# Altium project RPi-CM-Lite.PrjPcb (part 3 of 5)
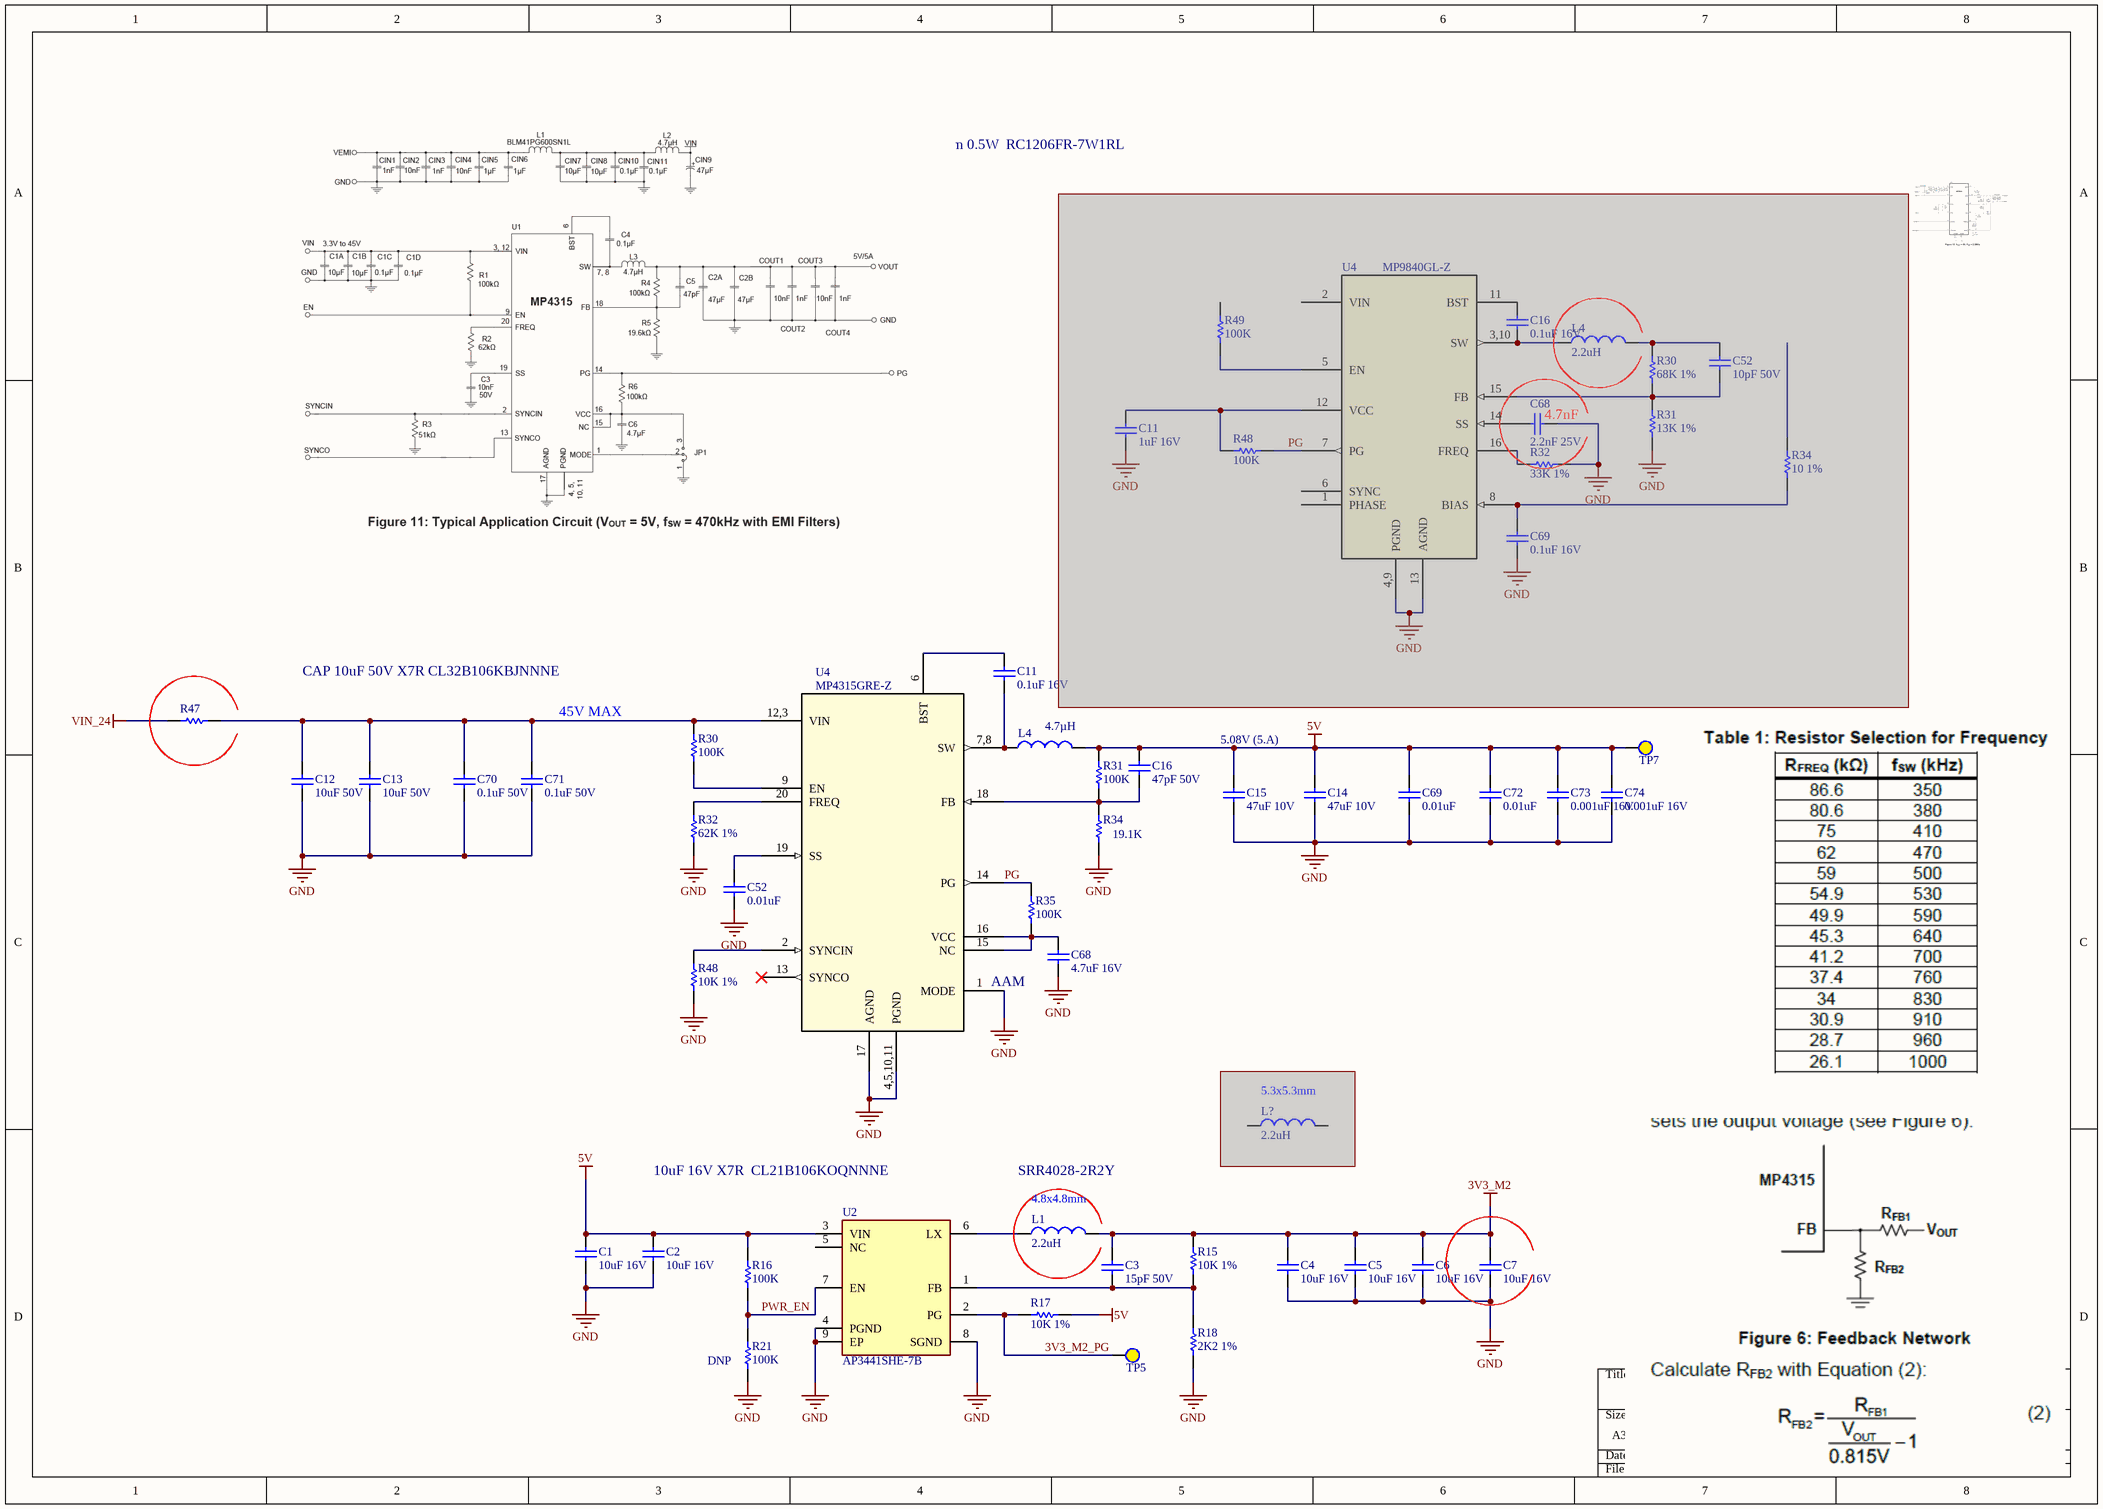
[diagram p8: Power.SchDoc]

## Sheet Power.SchDoc (continued)

### Library data of the parts (continued)
R34#2 = Res_19K1_0402: Res Thick Film 0402 19.1K Ohm 1% 0.063W(1/16W) ±100ppm/C Pad SMD T/R Automotive AEC-Q200; Manufacturer: Yageo Group; Manufacturer Part Number: AC0402FR-0719K1L; Value: 19.1kΩ; Temperature Coefficient: 100ppm/°C; Max Power Dissipation: 63mW; Power Dissipation: 62.5mW; Voltage Rating: 50V; Supplier 1: Mouser; RoHS: Compliant; Category: Chip SMD Resistors; Packaging: Tape & Reel; Tolerance: 1%; Composition: Thick Film; Features: Automotive AEC-Q200, Moisture Resistant; Height: 320µm; Number of Terminations: 2; ComponentLink1URL: https://datasheet.octopart.com:443/AC0402FR-0719K1L-Yageo-datasheet-182189377.pdf?src-supplier=IHS; ComponentLink1Description: https://datasheet.octopart.com:443/AC0402FR-0719K1L-Yageo-datasheet-182189377.pdf?src-supplier=IHS; Supplier Part Number 1: 603-AC0402FR-0719K1L; Supplier: Mouser; Supplier Part Number: 603-AC0402FR-0719K1L; Stock: 45979; Pricing: 1=0.1, 1=0.086, 10=0.008, 10=0.007, 50=0.008, 100=0.005, 100=0.004, 1000=0.005, 10000=0.002, 10000=0.002 (USD); Case/Package: 0402; Case Code (Imperial): 0402; Case Code (Metric): 1005; China RoHS: Non-Compliant; Length: 990.6µm; Lifecycle Status: Production; Max Operating Temperature: 155°C; Min Operating Temperature: -55°C; Mounting Technology: Surface Mount; Number of Terminals: 2; Power Rating: 62.5mW; REACH SVHC: Yes; Schedule B: 8533210045, 8533210045|8533210045|8533210045|8533210045|8533210045; Termination: SMD/SMT; Weight: 652.039032µg; Width: 500µm; Working Voltage: 50V; ComponentLink2URL: https://datasheet.octopart.com:443/AC0402FR-0719K1L-Yageo-datasheet-83209224.pdf?src-supplier=Upverter; ComponentLink2Description: https://datasheet.octopart.com:443/AC0402FR-0719K1L-Yageo-datasheet-83209224.pdf?src-supplier=Upverter; ComponentLink3URL: https://datasheet.octopart.com:443/AC0402FR-0719K1L-Yageo-datasheet-178509465.pdf?src-supplier=element14+APAC; ComponentLink3Description: https://datasheet.octopart.com:443/AC0402FR-0719K1L-Yageo-datasheet-178509465.pdf?src-supplier=element14+APAC; ComponentLink4URL: https://datasheet.octopart.com:443/AC0402FR-0719K1L-Yageo-datasheet-166720450.pdf?src-supplier=Future+Electronics; ComponentLink4Description: https://datasheet.octopart.com:443/AC0402FR-0719K1L-Yageo-datasheet-166720450.pdf?src-supplier=Future+Electronics; ComponentLink5URL: https://datasheet.octopart.com:443/AC0402FR-0719K1L-Yageo-datasheet-151884373.pdf?src-supplier=Future+Electronics; ComponentLink5Description: https://datasheet.octopart.com:443/AC0402FR-0719K1L-Yageo-datasheet-151884373.pdf?src-supplier=Future+Electronics; ComponentLink6URL: https://datasheet.octopart.com:443/AC0402FR-0719K1L-Yageo-datasheet-137699919.pdf?src-supplier=Future+Electronics; ComponentLink6Description: https://datasheet.octopart.com:443/AC0402FR-0719K1L-Yageo-datasheet-137699919.pdf?src-supplier=Future+Electronics; ComponentLink7URL: https://datasheet.octopart.com:443/AC0402FR-0719K1L-Yageo-Group-datasheet-164768995.pdf?src-supplier=ODG+(Origin+Data+Global); ComponentLink7Description: https://datasheet.octopart.com:443/AC0402FR-0719K1L-Yageo-Group-datasheet-164768995.pdf?src-supplier=ODG+(Origin+Data+Global); ComponentLink8URL: https://datasheet.octopart.com/AC0402FR-0719K1L-Yageo-datasheet-12512238.pdf; ComponentLink8Description: https://datasheet.octopart.com/AC0402FR-0719K1L-Yageo-datasheet-12512238.pdf; ComponentLink9URL: https://datasheet.octopart.com:443/AC0402FR-0719K1L-Yageo-datasheet-140571090.pdf?src-supplier=Arrow.cn; ComponentLink9Description: https://datasheet.octopart.com:443/AC0402FR-0719K1L-Yageo-datasheet-140571090.pdf?src-supplier=Arrow.cn; ComponentLink10URL: http://sigma.octopart.com:80/rohs_statement/Yageo-company-2.pdf?src-supplier=Compliance+Statements; ComponentLink10Description: http://sigma.octopart.com:80/rohs_statement/Yageo-company-2.pdf?src-supplier=Compliance+Statements; ComponentLink11URL: http://sigma.octopart.com:80/conflict_mineral_statement/Yageo-company-3.pdf?src-supplier=Compliance+Statements; ComponentLink11Description: http://sigma.octopart.com:80/conflict_mineral_statement/Yageo-company-3.pdf?src-supplier=Compliance+Statements
R47 = Res_1206: Resistor 1206
U2 = AP3441SHE-7B: DC-DC Switching Buck Regulator, Adjustable, 2.7 V to 5.5V in, 0.6 V to 5.5 V/3 A out, UDFN2020-EP-8; Manufacturer_Name: Diodes Incorporated; Manufacturer: Diodes Inc.; Max Switching Frequency: 1.2MHz; Min Input Voltage: 2.7V; Min Output Voltage: 600mV; Nominal Supply Voltage: 5V; Nominal Output Voltage: 2.5V; Number of Circuits: 1; Datasheet Link: https://www.diodes.com//assets/Datasheets/AP3441-L.pdf; Height: 0.6mm; Manufacturer_Part_Number: AP3441SHE-7B; Mouser Part Number: 621-AP3441SHE-7B; Mouser Price/Stock: https://www.mouser.co.uk/ProductDetail/Diodes-Incorporated/AP3441SHE-7B?qs=wUXugUrL1qwsM8sMU6r4Ag%3D%3D; Arrow Part Number: AP3441SHE-7B; Arrow Price/Stock: https://www.arrow.com/en/products/ap3441she-7b/diodes-incorporated?region=nac; Supplier: Mouser; Supplier Part Number: 621-AP3441SHE-7B; Manufacturer Part Number: AP3441SHE-7B; RoHS: Compliant; Category: Voltage Regulators - Switching; Stock: 7594; Pricing: 1=0.31, 10=0.215, 50=0.191, 100=0.164, 1000=0.138, 10000=0.127 (USD); China RoHS: Compliant; Height - Seated (Max): 600µm; Length: 2mm; Lifecycle Status: Production; Max Supply Voltage: 5.5V; Max Operating Temperature: 85°C; Max Output Voltage: 5.5V; Min Operating Temperature: -40°C; Number of Terminals: 8; Operating Supply Voltage: 5V; REACH SVHC: Yes; Terminal Pitch: 500µm; Topology: Buck; Width: 2mm; ComponentLink1URL: https://datasheet.octopart.com:443/AP3441SHE-7B-Diodes-Inc.-datasheet-151209809.pdf?src-supplier=element14+APAC; ComponentLink1Description: https://datasheet.octopart.com:443/AP3441SHE-7B-Diodes-Inc.-datasheet-151209809.pdf?src-supplier=element14+APAC; ComponentLink2URL: https://sigma.octopart.com:443/151209808/technical_drawing/Diodes-Inc.-AP3441SHE-7B.pdf?src-supplier=Diodes+Inc+SCT; ComponentLink2Description: https://sigma.octopart.com:443/151209808/technical_drawing/Diodes-Inc.-AP3441SHE-7B.pdf?src-supplier=Diodes+Inc+SCT; Supplier 1: Mouser; Supplier Part Number 1: 621-AP3441SHE-7B
U4#1 = MP9840GL-Z: Switching Regulator, Current-mode, 3.5A, 2750kHz Switching Freq-Max; Manufacturer_Name: Monolithic Power Systems; Manufacturer Lifecycle Status: ACTIVE; Max Supply Voltage: 36V; Max Switching Frequency: 2.75MHz; Min Input Voltage: 3.3V; Nominal Supply Voltage: 12V; Number of Circuits: 1; Topology: Buck; Copyright: Copyright (C) 2025 Ultra Librarian. All rights reserved.; Manufacturer_Part_Number: MP9840GL-Z; Datasheet: https://www.monolithicpower.com/en/documentview/productdocument/index/version/2/document_type/Datasheet/lang/en/sku/MP9840GL; RefDes: RefDes; Type: Type; Supplier: Mouser; Supplier Part Number: 946-MP9840GL-Z; Manufacturer: Monolithic Power Systems; Manufacturer Part Number: MP9840GL-Z; RoHS: Compliant; Category: Voltage Regulators - Switching; Stock: 5000; Pricing: 1=2.56, 1=2.2, 10=1.91, 10=1.64, 25=1.51, 50=1.75, 100=1.57, 100=1.35, 250=1.27, 500=1.23, 1000=1.39, 1000=1.2, 2500=1.15, 5000=1.1, 10000=1.28 (USD); Height - Seated (Max): 1mm; Length: 4mm; Lifecycle Status: Production; Max Operating Temperature: 125°C; Max Output current: 3.5A; Min Operating Temperature: -40°C; Number of Terminals: 16; REACH SVHC: Yes; Terminal Pitch: 650µm; Width: 3mm; ComponentLink1URL: https://datasheet.octopart.com:443/MP9840GL-Z-Monolithic-Power-Systems-datasheet-163721617.pdf?src-supplier=Monolithic+Power+Systems; ComponentLink1Description: https://datasheet.octopart.com:443/MP9840GL-Z-Monolithic-Power-Systems-datasheet-163721617.pdf?src-supplier=Monolithic+Power+Systems; ComponentLink2URL: https://datasheet.octopart.com:443/MP9840GL-Z-Monolithic-Power-Systems-datasheet-180788465.pdf?src-supplier=IHS; ComponentLink2Description: https://datasheet.octopart.com:443/MP9840GL-Z-Monolithic-Power-Systems-datasheet-180788465.pdf?src-supplier=IHS; Supplier 1: Mouser; Supplier Part Number 1: 946-MP9840GL-Z
U4#2 = MP4315GRE-Z: MP4315 Series 45 V 5 A 1 MHz Surface Mount Buck Switching Regulator - QFN-20; Manufacturer_Name: Monolithic Power Systems; Manufacturer Lifecycle Status: ACTIVE; Max Supply Voltage: 45V; Max Output current: 5A; Max Output Voltage: 42.75V; Max Switching Frequency: 1.18MHz; Min Input Voltage: 3.3V; Min Output Voltage: 815mV; Nominal Supply Voltage: 12V; Number of Circuits: 1; Copyright: Copyright (C) 2025 Ultra Librarian. All rights reserved.; Manufacturer_Part_Number: MP4315GRE-Z; Datasheet: https://www.monolithicpower.com/en/documentview/productdocument/index/version/2/document_type/Datasheet/lang/en/sku/MP4315GRE; RefDes: RefDes; Type: Type; Supplier: DigiKey; Supplier Part Number: 1589-MP4315GRE-ZCT-ND; Manufacturer: Monolithic Power Systems; Manufacturer Part Number: MP4315GRE-Z; RoHS: Compliant; Category: Voltage Regulators - Switching; Stock: 1665; Pricing: 1=3.05, 10=2.285, 25=2.0928, 100=1.8822, 250=1.78168, 500=1.72112, 1000=1.67128, 2500=1.61865, 5000=1.58693 (USD); Height - Seated (Max): 1mm; Length: 4mm; Lifecycle Status: Production; Max Operating Temperature: 125°C; Min Operating Temperature: -40°C; Number of Terminals: 20; REACH SVHC: Yes; Topology: Buck; Width: 4mm; ComponentLink1URL: https://datasheet.octopart.com:443/MP4315GRE-Z-Monolithic-Power-Systems-datasheet-163719716.pdf?src-supplier=Monolithic+Power+Systems; ComponentLink1Description: https://datasheet.octopart.com:443/MP4315GRE-Z-Monolithic-Power-Systems-datasheet-163719716.pdf?src-supplier=Monolithic+Power+Systems; ComponentLink2URL: https://datasheet.octopart.com:443/MP4315GRE-Z-Monolithic-Power-Systems-datasheet-180787007.pdf?src-supplier=IHS; ComponentLink2Description: https://datasheet.octopart.com:443/MP4315GRE-Z-Monolithic-Power-Systems-datasheet-180787007.pdf?src-supplier=IHS; ComponentLink3URL: https://datasheet.octopart.com:443/MP4315GRE-Z-Monolithic-Power-Systems-datasheet-158879094.pdf?src-supplier=Future+Electronics; ComponentLink3Description: https://datasheet.octopart.com:443/MP4315GRE-Z-Monolithic-Power-Systems-datasheet-158879094.pdf?src-supplier=Future+Electronics; Supplier 1: DigiKey; Supplier Part Number 1: 1589-MP4315GRE-ZCT-ND

## Sheet MIPI-CSI.SchDoc
size A3; SheetNumber: 4; SheetTotal: 7
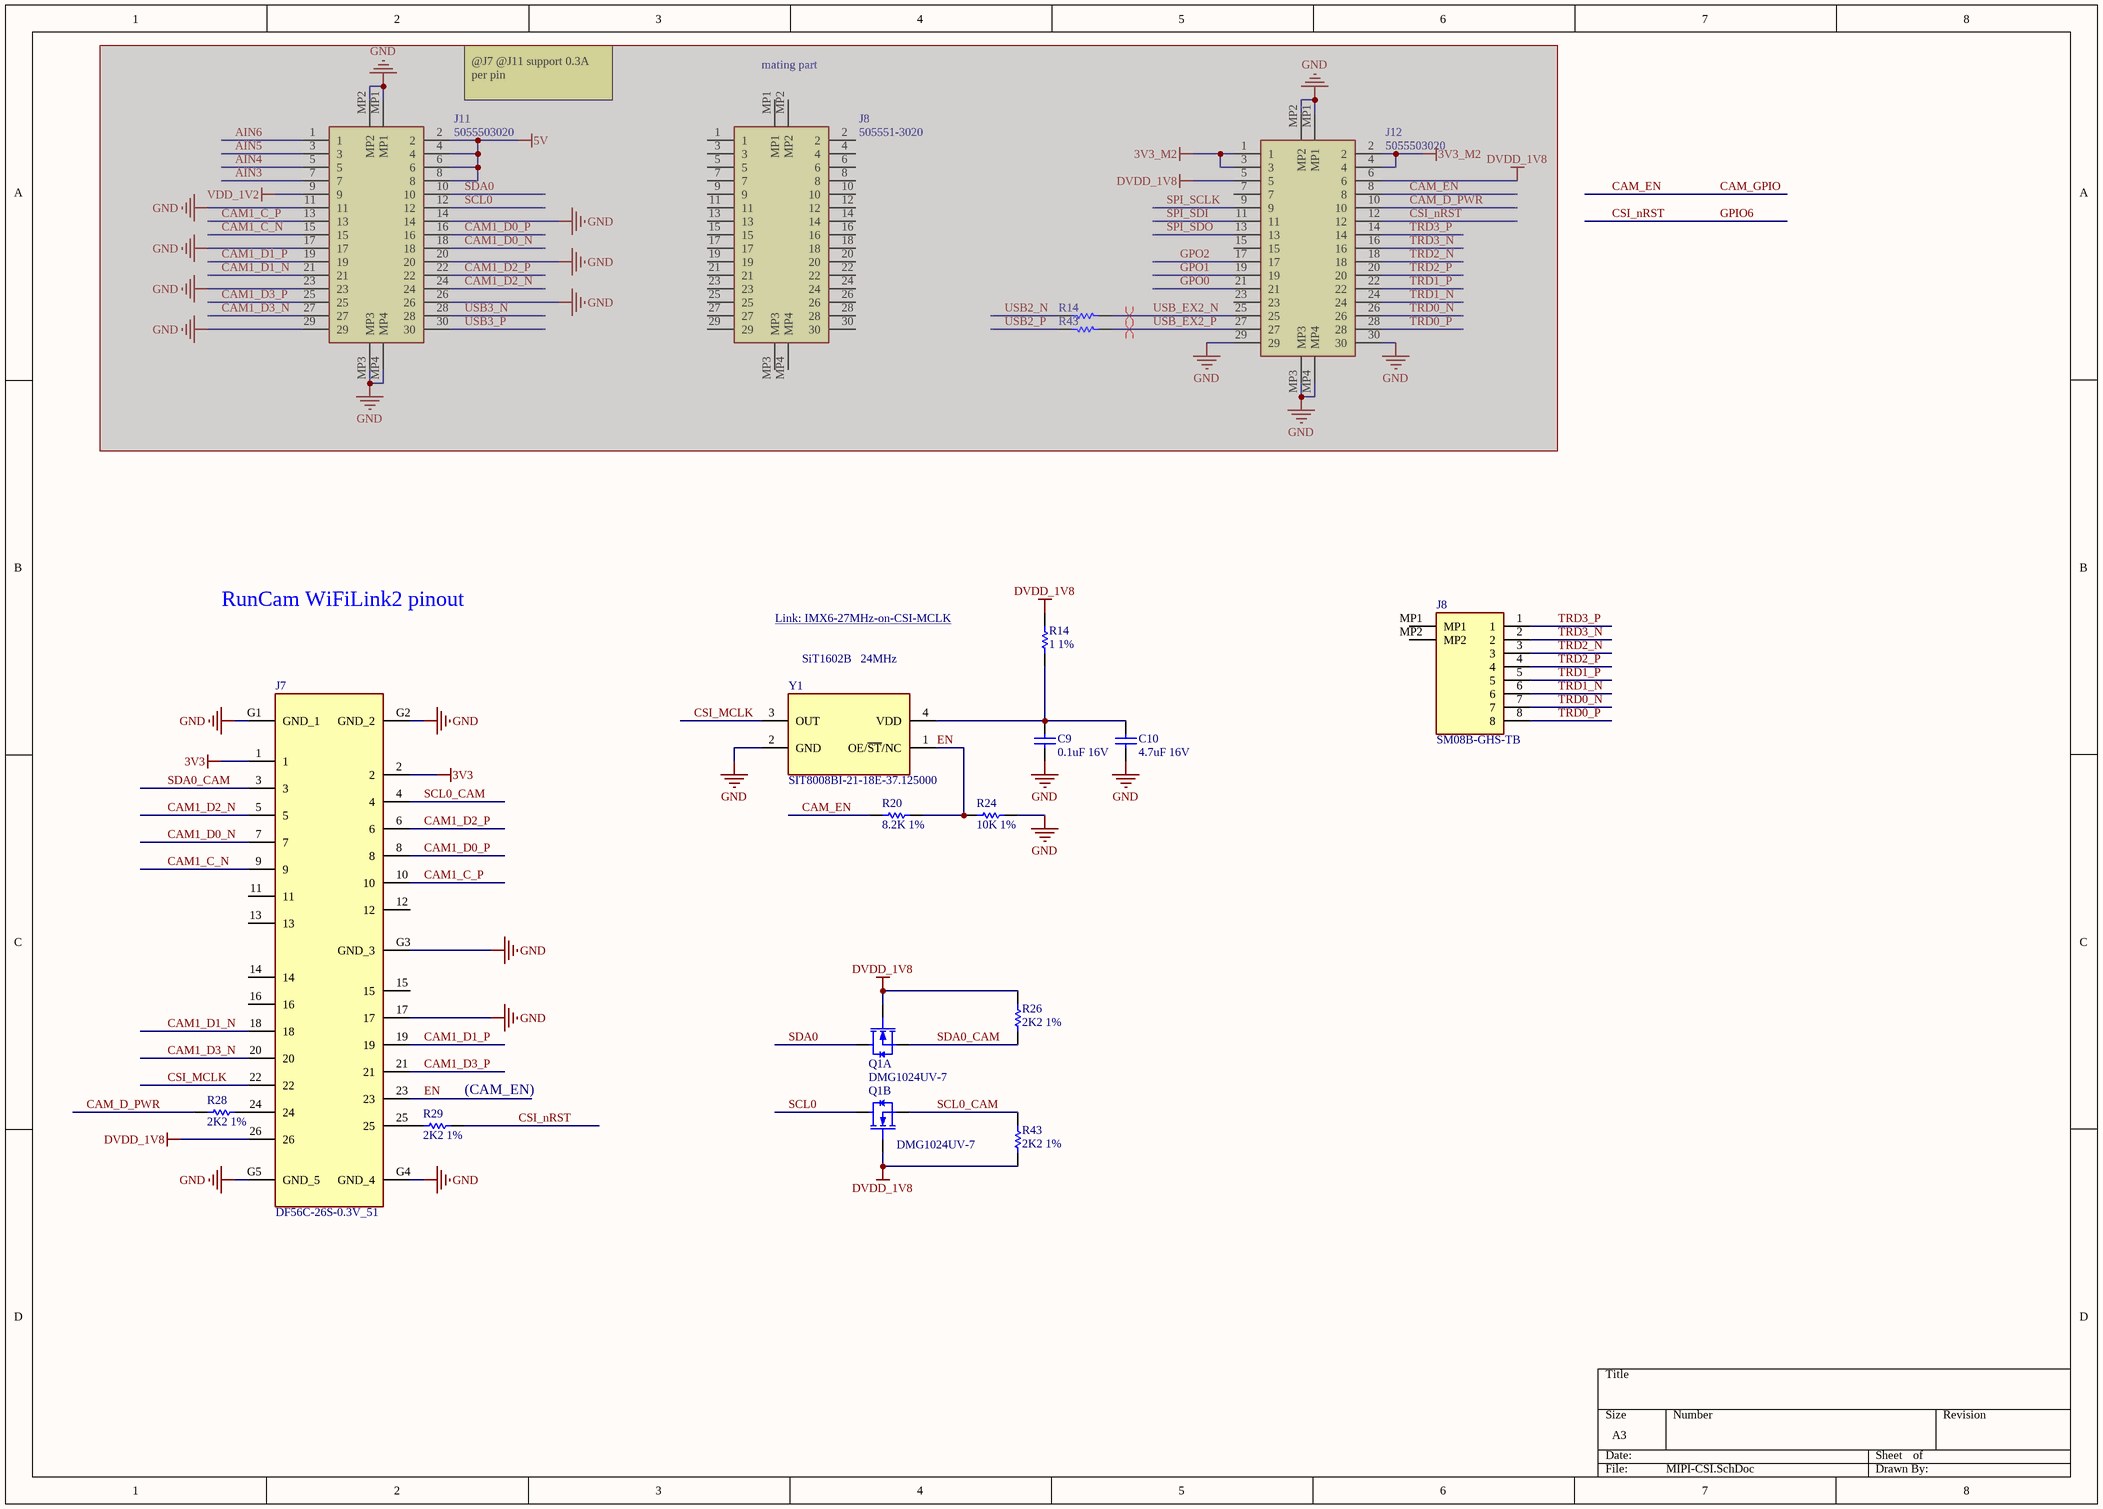
[diagram p3: MIPI-CSI.SchDoc]

### Parts
(Parts that share a designator on the sheet are numbered #1, #2 ... from top to bottom, then left to right.)
C9  0.1uF 16V  [0402]
C10  4.7uF 16V  [1608[0603]]
J7  DF56C-26S-0.3V_51  [DF56C26S03V51]
J8#1  505551-3020  [5055513020]  (masked out: inside a compile mask, not in the netlist)
J8#2  SM08B-GHS-TB  [SM08BGHSTBLFSN]
J11#2  5055503020  [5055503020]  (masked out: inside a compile mask, not in the netlist)
J12  5055503020  [5055503020]  (masked out: inside a compile mask, not in the netlist)
Q1  DMG1024UV-7  [SOT563]  (parts A,B of 2)
R14#1  0R  [0402]  (value not drawn)  (masked out: inside a compile mask, not in the netlist)
R14#2  1 1%  [0402]
R20  8.2K 1%  [0402]
R24  10K 1%  [0402]
R26  2K2 1%  [0402]
R28  2K2 1%  [0402]
R29  2K2 1%  [0402]
R43#1  0R  [0402]  (value not drawn)  (masked out: inside a compile mask, not in the netlist)
R43#2  2K2 1%  [0402]
Y1  SIT8008BI-21-18E-37.125000  [QFN_3225_4pins]

### Nets
3V3: J7.1 J7.2
DVDD_1V8: J7.26 Q1.2(G) Q1.5(G) R14#2.2 R26.2 R43#2.1
GND: C9.2 C10.1 J7.17 J7.G1(GND_1) J7.G2(GND_2) J7.G3(GND_3) J7.G4(GND_4) J7.G5(GND_5) R24.2 Y1.2(GND)
CAM1_C_N: J7.9
CAM1_C_P: J7.10
CAM1_D0_N: J7.7
CAM1_D0_P: J7.8
CAM1_D1_N: J7.18
CAM1_D1_P: J7.19
CAM1_D2_N: J7.5
CAM1_D2_P: J7.6
CAM1_D3_N: J7.20
CAM1_D3_P: J7.21
CAM_D_PWR: R28.2
CAM_EN: R20.1  [also labelled CAM_GPIO]
CSI_MCLK: J7.22 Y1.3(OUT)
CSI_nRST: R29.1  [also labelled GPIO6]
EN: J7.23 R20.2 R24.1 Y1.1(OE/~{ST}/NC)
SCL0: Q1.6(D)
SCL0_CAM: J7.4 Q1.1(S) R43#2.2
SDA0: Q1.3(D)
SDA0_CAM: J7.3 Q1.4(S) R26.1
TRD0_N: J8#2.7
TRD0_P: J8#2.8
TRD1_N: J8#2.6
TRD1_P: J8#2.5
TRD2_N: J8#2.3
TRD2_P: J8#2.4
TRD3_N: J8#2.2
TRD3_P: J8#2.1
NetC9_1: C9.1 C10.2 R14#2.1 Y1.4(VDD)
NetJ7_24: J7.24 R28.1
NetJ7_25: J7.25 R29.2

Not connected (* = marked no-connect by the designer): J7 11 12 13 14 15 16; J8#2 MP1 MP2

### Layout directives
differential pair; differential pair class USB: (no net found under the mark)

### Notes on the sheet
- (near J11#2) @J7 @J11 support 0.3A per pin
- mating part
- RunCam WiFiLink2 pinout
- Link: IMX6-27MHz-on-CSI-MCLK <https://community.nxp.com/t5/i-MX-Processors/IMX6-27MHz-on-CSI-MCLK/td-p/926021>
- SiT1602B   24MHz
- (near R29) (CAM_EN)

### Library data of the parts
C9 = Cap0.1UF_16V_X7R: 0402 0.1 uF 16V ±10% Tolerance X7R SMT Multilayer Ceramic Capacitor; Manufacturer: Murata; Manufacturer Part Number: GCM155R71C104KA55J; Value: 100nF; RoHS: Yes; Category: Ceramic Capacitors; Stock 1: 2121057; Pricing 1: 1=0,10000, 10=0,01800, 50=0,01800, 100=0,01500, 1000=0,00900, 10000=0,00700 (USD); Mounting Technology: Surface Mount; Case/Package: 0402; Case Code (Imperial): 0402; Case Code (Metric): 1005; Min Operating Temperature: -55°C; Max Operating Temperature: 125°C; Tolerance: 10%; Voltage Rating: 16V; Voltage Rating (DC): 16V; Packaging: Tape and Reel; Package Quantity: 1; Dielectric: X7R; Termination: SMD/SMT; Series: GCM; Construction: Flat; Length: 1mm; Width: 0.5mm; Height: 0.5mm; Thickness: 0.022inch; Depth: 0.5mm; Ratings: AEC-Q200; Radiation Hardening: No; Lead Free: Lead Free; RoHS Compliant: Yes; ComponentLink1URL: https://datasheet.ciiva.com/11618/product-11618848.pdf?src-supplier=Avnet; ComponentLink1Description: https://datasheet.ciiva.com/11618/product-11618848.pdf?src-supplier=Avnet; ComponentLink2URL: https://datasheet.ciiva.com/16440/gcm155r71c104ka55j-16440393.pdf?src-supplier=Future+Electronics; ComponentLink2Description: https://datasheet.ciiva.com/16440/gcm155r71c104ka55j-16440393.pdf?src-supplier=Future+Electronics; ComponentLink3URL: https://datasheet.ciiva.com/29542/product-29542474.pdf?src-supplier=Digi-Key; ComponentLink3Description: https://datasheet.ciiva.com/29542/product-29542474.pdf?src-supplier=Digi-Key; ComponentLink4URL: https://datasheet.ciiva.com/29542/product-29542475.pdf?src-supplier=Digi-Key; ComponentLink4Description: https://datasheet.ciiva.com/29542/product-29542475.pdf?src-supplier=Digi-Key; Supplier 1: Mouser; Supplier 2: Digi-Key; Supplier Part Number 1: 81-GCM155R71C104KA5J; Supplier Part Number 2: 490-7998-1-ND
C10 = Cap4.7UF_16_0603: Ceramic Capacitor (Surface Mount); Manufacturer: Samsung Electro-Mechanics America, Inc.; Manufacturer Part Number: CL10A475KO8NNNC; Capacitance: 4.7µF; Tolerance: ±10%; Temperature Coefficient: X5R; Supplier 1: Digi-Key; RoHS: RoHS Compliant; Category: Capacitors; Stock 1: 166451; Pricing 1: 1=0.26, 10=0.216, 25=0.1484, 50=0.1216, 100=0.108, 500=0.07156, 1000=0.06345 (USD); Packaging: Cut Tape (CT); Voltage - Rated: 16V; Mounting Type: Surface Mount, MLCC; Operating Temperature: -55°C ~ 85°C; Applications: General Purpose; Ratings: -; Package / Case: 0603 (1608 Metric); Size / Dimension: 0.063" L x 0.031" W (1.60mm x 0.80mm); Height - Seated (Max): -; Thickness (Max): 0.035" (0.90mm); Lead Spacing: -; Features: -; Lead Style: -; ComponentLink1URL: http://www.samsungsem.com/kr/support/product-search/mlcc/CL10A475KO8NNNC.jsp; ComponentLink1Description: http://www.samsungsem.com/kr/support/product-search/mlcc/CL10A475KO8NNNC.jsp; Supplier Part Number 1: 1276-1784-1-ND
J7 = DF56C-26S-0.3V_51: Connector; Manufacturer_Name: Hirose; Manufacturer_Part_Number: DF56C-26S-0.3V(51); Datasheet Link: https://www.hirose.com/product/download/?distributor=digikey&type=2d&lang=en&num=DF56C-26S-0.3V(51); Height: 1.55mm; Mouser Part Number: 798-DF56C-26S-0.3V51; Mouser Price/Stock: https://www.mouser.co.uk/ProductDetail/Hirose-Connector/DF56C-26S-0.3V51?qs=Gufeu08L%2Fl3QSAbzBrso4w%3D%3D; Supplier 1: Digikey; Supplier Part Number 1: 26-DF56C-26S-0.3V(51)CT-ND
J8#1 = 505551-3020: Connector; Manufacturer_Name: Molex; Datasheet Link: https://www.mouser.jp/datasheet/2/276/2/5055513020_PCB_HEADERS-1532243.pdf; Height: 0.78mm; Manufacturer_Part_Number: 505551-3020; Mouser Part Number: 538-505551-3020; Mouser Price/Stock: https://www.mouser.co.uk/ProductDetail/Molex/505551-3020?qs=0lSvoLzn4L8hAqcUMwSy%252BQ%3D%3D
J8#2 = SM08B-GHS-TB__LF__SN_: Conn Shrouded Header HDR 8 POS 1.25mm Solder RA Side Entry SMD T/R; Manufacturer_Name: JST (JAPAN SOLDERLESS TERMINALS); Manufacturer_Part_Number: SM08B-GHS-TB (LF)(SN); Manufacturer: JST; Manufacturer Part Number: SM08B-GHS-TB(LF)(SN); Connector Type: Male Pin, Outer Shroud Contact; Contact Resistance: 50mΩ; Current Rating: 1A; Dielectric Material: Polyamide; Insulation Resistance: 100MΩ; Number of Contacts: 8; Pitch: 1.2446mm; Voltage Rating: 50V; Datasheet Link: https://www.arrow.com/en/products/sm08b-ghs-tb-lf-sn/jst-manufacturing; Height: 4.25mm; Arrow Part Number: SM08B-GHS-TB (LF)(SN); Arrow Price/Stock: https://www.arrow.com/en/products/sm08b-ghs-tb-lf-sn/jst-manufacturing; Supplier: Mouser; Supplier Part Number: 306-SM08BGHSTBLFSN; RoHS: Compliant; Category: Headers and Wire Housings; Pricing: 1=0.53, 10=0.45, 50=0.45, 100=0.383, 1000=0.259, 10000=0.239 (USD); Color: Natural; Contact Gender: Male; Contact Material: Copper, Tin; Contact Plating: Tin; Fastening Type: Latch, Ramp; Housing Color: Natural; Housing Material: Nylon; Lead Free: Lead Free; Lifecycle Status: Production; Max Operating Temperature: 85°C; Manufacturer Package Identifier: SM08B-GHS-TB(LF)(SN); Min Operating Temperature: -25°C; Mounting Technology: Surface Mount; Pins: 8; Number of Positions: 8; Number of Rows: 1; Terminal Pitch: 1.25mm; Termination: Solder; ComponentLink1URL: https://datasheet.octopart.com:443/SM08B-GHS-TB%28LF%29%28SN%29-JST-datasheet-13551083.pdf?src-supplier=Factory+Futures; ComponentLink1Description: https://datasheet.octopart.com:443/SM08B-GHS-TB%28LF%29%28SN%29-JST-datasheet-13551083.pdf?src-supplier=Factory+Futures; ComponentLink2URL: https://datasheet.octopart.com:443/SM08B-GHS-TB%28LF%29%28SN%29-JST-datasheet-12527556.pdf?src-supplier=Factory+Futures; ComponentLink2Description: https://datasheet.octopart.com:443/SM08B-GHS-TB%28LF%29%28SN%29-JST-datasheet-12527556.pdf?src-supplier=Factory+Futures; ComponentLink3URL: https://datasheet.octopart.com:443/SM08B-GHS-TB%28LF%29%28SN%29-JST-datasheet-151632282.pdf?src-supplier=Upverter; ComponentLink3Description: https://datasheet.octopart.com:443/SM08B-GHS-TB%28LF%29%28SN%29-JST-datasheet-151632282.pdf?src-supplier=Upverter; ComponentLink4URL: https://datasheet.octopart.com:443/SM08B-GHS-TB%28LF%29%28SN%29-JST-datasheet-10511.pdf?src-supplier=Farnell; ComponentLink4Description: https://datasheet.octopart.com:443/SM08B-GHS-TB%28LF%29%28SN%29-JST-datasheet-10511.pdf?src-supplier=Farnell; ComponentLink5URL: https://datasheet.octopart.com:443/SM08B-GHS-TB-%28LF%29%28SN%29-JST-datasheet-28358378.pdf?src-supplier=TME; ComponentLink5Description: https://datasheet.octopart.com:443/SM08B-GHS-TB-%28LF%29%28SN%29-JST-datasheet-28358378.pdf?src-supplier=TME; Supplier 1: Mouser; Supplier Part Number 1: 306-SM08BGHSTBLFSN
J11#2 J12 = 5055503020: Connector; Manufacturer_Name: Molex; Datasheet Link: https://datasheet.datasheetarchive.com/originals/distributors/Datasheets_SAMA/1c3ca4815b843d293d2ef52135fd0fae.pdf; Height: 0.76mm; Manufacturer_Part_Number: 5055503020; Supplier 1: Mouser; Supplier Part Number 1: 538-505550-3020
Q1 = MOSFET_DMG1024UV-7: Transistor MOSFET Array Dual N-CH 20V 1.38A 6-Pin SOT-563 T/R; Manufacturer: Diodes Inc.; Continuous Drain Current (ID): 1.39A; Drain to Source Resistance: 450mΩ; Fall Time: 12.3ns; Gate to Source Voltage (Vgs): 6V; Input Capacitance: 60.67pF; Max Power Dissipation: 530mW; Number of Channels: 2; Value: 10Ω; Rise Time: 7.4ns; Turn-Off Delay Time: 26.7ns; Turn-On Delay Time: 5.1ns; Supplier: Mouser; Supplier Part Number: 621-DMG1024UV-7; Manufacturer Part Number: DMG1024UV-7; RoHS: Compliant; Category: MOSFETs; Stock: 21634; Pricing: 1=0.54, 10=0.335, 50=0.335, 100=0.17, 1000=0.123, 10000=0.104 (USD); Case/Package: SOT-563; China RoHS: Compliant; Drain to Source Breakdown Voltage: 20V; Drain to Source Voltage (Vdss): 20V; Element Configuration: Dual; Height: 600µm; Lead Free: Lead Free; Length: 1.7mm; Lifecycle Status: Production; Max Operating Temperature: 150°C; Min Breakdown Voltage: 20V; Min Operating Temperature: -55°C; Mounting Technology: Surface Mount; Number of Elements: 2; Pins: 6; Number of Terminals: 6; Power Dissipation: 530mW; Radiation Hardening: No; Rds On Max: 450mΩ; REACH SVHC: Yes; Schedule B: 8541210080, 8541210080|8541210080|8541210080|8541210080|8541210080; Weight: 3.005049mg; Width: 1.25mm; ComponentLink1URL: https://datasheet.octopart.com:443/DMG1024UV-7-Diodes-Inc.-datasheet-11784105.pdf?src-supplier=IHS; ComponentLink1Description: https://datasheet.octopart.com:443/DMG1024UV-7-Diodes-Inc.-datasheet-11784105.pdf?src-supplier=IHS; ComponentLink2URL: https://sigma.octopart.com:443/138896152/technical_drawing/Diodes-Inc.-DMG1024UV-7.pdf?src-supplier=Diodes+Inc+SCT; ComponentLink2Description: https://sigma.octopart.com:443/138896152/technical_drawing/Diodes-Inc.-DMG1024UV-7.pdf?src-supplier=Diodes+Inc+SCT; ComponentLink3URL: http://sigma.octopart.com:80/15540767/rohs_statement/Diodes-Inc.-DMG1024UV-7.pdf?src-supplier=Compliance+Statements; ComponentLink3Description: http://sigma.octopart.com:80/15540767/rohs_statement/Diodes-Inc.-DMG1024UV-7.pdf?src-supplier=Compliance+Statements; Supplier 1: Mouser; Supplier Part Number 1: 621-DMG1024UV-7
R14#1 R43#1 = Res_0R_0402: Zero ohm Jumper 0402; Manufacturer: Yageo; Manufacturer Part Number: RC0402JR-070RL; Resistance (Ohms): 0.0; Power (Watts): 0.063W, 1/16W; Value: 0R; Supplier 1: Digi-Key; RoHS: RoHS Compliant; Category: Resistors; Stock 1: 12447313; Pricing 1: 1=0.1, 10=0.013, 25=0.0092, 100=0.0053, 250=0.004, 500=0.0032, 1000=0.00236, 2500=0.00205, 5000=0.00169 (USD); Packaging: Cut Tape (CT); Tolerance: Jumper; Composition: Thick Film; Features: Moisture Resistant; Temperature Coefficient: -; Operating Temperature: -55°C ~ 155°C; Package / Case: 0402 (1005 Metric); Supplier Device Package: 0402; Size / Dimension: 0.039" L x 0.020" W (1.00mm x 0.50mm); Height: 0.016" (0.40mm); Number of Terminations: 2; ComponentLink1URL: http://www.yageo.com/documents/recent/PYu-RC_Group_51_RoHS_L_2.pdf; ComponentLink1Description: http://www.yageo.com/documents/recent/PYu-RC_Group_51_RoHS_L_2.pdf; Supplier Part Number 1: 311-0.0JRCT-ND; MountType: SMT
R14#2 = Res_1R_0402: Resistor; Manufacturer: Vishay Dale; Manufacturer Part Number: CRCW04021R00FKEDHP; Resistance (Ohms): 1; Power (Watts): 0.125W, 1/8W; Temperature Coefficient: ±100ppm/°C; Supplier 1: Digi-Key; RoHS: RoHS Compliant; Category: Resistors; Stock 1: 35654; Pricing 1: 10=0.199, 50=0.1074, 200=0.06165, 1000=0.04205 (USD); Packaging: Cut Tape (CT); Tolerance: ±1%; Composition: Thick Film; Features: Automotive AEC-Q200, Pulse Withstanding; Operating Temperature: -55°C ~ 155°C; Package / Case: 0402 (1005 Metric); Supplier Device Package: 0402 (1005 Metric); Size / Dimension: 0.039" L x 0.020" W (1.00mm x 0.50mm); Height: 0.016" (0.40mm); Number of Terminations: 2; ComponentLink1URL: http://www.vishay.com/docs/20043/crcwhpe3.pdf; ComponentLink1Description: http://www.vishay.com/docs/20043/crcwhpe3.pdf; Supplier Part Number 1: 541-1.00YCT-ND; MountType: SMT
R20 = Res_8K2_0402: Res Thick Film 0402 8.2K Ohm 1% 0.063W(1/16W) ±100ppm/°C Pad SMD T/R Automotive AEC-Q200; Manufacturer: Yageo Group; Manufacturer Part Number: AC0402FR-138K2L; Power Dissipation: 62.5mW; Value: 8.2kΩ; Voltage Rating: 50V; Supplier: Mouser; Supplier Part Number: 603-AC0402FR-138K2L; RoHS: Compliant; Category: Chip SMD Resistors; Stock: 92115; Pricing: 1=0.1, 1=0.086, 10=0.012, 10=0.010, 50=0.012, 100=0.009, 100=0.008, 1000=0.008, 1000=0.007, 2500=0.005, 10000=0.004, 10000=0.003, 50000=0.002 (USD); Case/Package: 0402; China RoHS: Non-Compliant; Composition: Thick Film; Height: 320µm; Lifecycle Status: Production; Max Operating Temperature: 155°C; Min Operating Temperature: -55°C; Mounting Technology: Surface Mount; Number of Terminals: 2; Packaging: Tape & Reel; Power Rating: 62.5mW; REACH SVHC: Yes; Temperature Coefficient: 100ppm/°C; Tolerance: 1%; Width: 500µm; Working Voltage: 50V; ComponentLink1URL: https://datasheet.octopart.com:443/AC0402FR-138K2L-Yageo-datasheet-182189377.pdf?src-supplier=IHS; ComponentLink1Description: https://datasheet.octopart.com:443/AC0402FR-138K2L-Yageo-datasheet-182189377.pdf?src-supplier=IHS; ComponentLink2URL: https://datasheet.octopart.com:443/AC0402FR-138K2L-Yageo-datasheet-83209224.pdf?src-supplier=Upverter; ComponentLink2Description: https://datasheet.octopart.com:443/AC0402FR-138K2L-Yageo-datasheet-83209224.pdf?src-supplier=Upverter; ComponentLink3URL: https://datasheet.octopart.com:443/AC0402FR-138K2L-Yageo-datasheet-178509465.pdf?src-supplier=Newark; ComponentLink3Description: https://datasheet.octopart.com:443/AC0402FR-138K2L-Yageo-datasheet-178509465.pdf?src-supplier=Newark; ComponentLink4URL: https://datasheet.octopart.com:443/AC0402FR-138K2L-Yageo-datasheet-166720450.pdf?src-supplier=Future+Electronics; ComponentLink4Description: https://datasheet.octopart.com:443/AC0402FR-138K2L-Yageo-datasheet-166720450.pdf?src-supplier=Future+Electronics; ComponentLink5URL: https://datasheet.octopart.com:443/AC0402FR-138K2L-Yageo-datasheet-151884373.pdf?src-supplier=Future+Electronics; ComponentLink5Description: https://datasheet.octopart.com:443/AC0402FR-138K2L-Yageo-datasheet-151884373.pdf?src-supplier=Future+Electronics; ComponentLink6URL: https://datasheet.octopart.com:443/AC0402FR-138K2L-Yageo-datasheet-137699919.pdf?src-supplier=Future+Electronics; ComponentLink6Description: https://datasheet.octopart.com:443/AC0402FR-138K2L-Yageo-datasheet-137699919.pdf?src-supplier=Future+Electronics; ComponentLink7URL: https://datasheet.octopart.com/AC0402FR-138K2L-Yageo-datasheet-12512238.pdf; ComponentLink7Description: https://datasheet.octopart.com/AC0402FR-138K2L-Yageo-datasheet-12512238.pdf; ComponentLink8URL: http://sigma.octopart.com:80/conflict_mineral_statement/Yageo-company-3.pdf?src-supplier=Compliance+Statements; ComponentLink8Description: http://sigma.octopart.com:80/conflict_mineral_statement/Yageo-company-3.pdf?src-supplier=Compliance+Statements; ComponentLink9URL: http://sigma.octopart.com:80/rohs_statement/Yageo-company-2.pdf?src-supplier=Compliance+Statements; ComponentLink9Description: http://sigma.octopart.com:80/rohs_statement/Yageo-company-2.pdf?src-supplier=Compliance+Statements; Supplier 1: Mouser; Supplier Part Number 1: 603-AC0402FR-138K2L
R24 = Res_10K_0402: Resistor; Manufacturer: Yageo; Manufacturer Part Number: RC0402FR-0710KL; Power (Watts): 0.063W, 1/16W; Temperature Coefficient: ±100ppm/°C; Supplier 1: Digi-Key; RoHS: RoHS Compliant; Category: Resistors; Stock 1: 2634839; Pricing 1: 1=0.1, 10=0.013, 25=0.0096, 100=0.0054, 250=0.00412, 500=0.00328, 1000=0.00242, 2500=0.0021, 5000=0.00173 (USD); Packaging: Cut Tape (CT); Resistance (Ohms): 10k; Tolerance: ±1%; Composition: Thick Film; Features: Moisture Resistant; Operating Temperature: -55°C ~ 155°C; Package / Case: 0402 (1005 Metric); Supplier Device Package: 0402; Size / Dimension: 0.039" L x 0.020" W (1.00mm x 0.50mm); Height: 0.016" (0.40mm); Number of Terminations: 2; ComponentLink1URL: http://www.yageo.com/NewPortal/yageodocoutput?fileName=/pdf/R-Chip/PYu-RC_Group_51_RoHS_L_3.pdf; ComponentLink1Description: http://www.yageo.com/NewPortal/yageodocoutput?fileName=/pdf/R-Chip/PYu-RC_Group_51_RoHS_L_3.pdf; Supplier Part Number 1: 311-10.0KLRCT-ND; MountType: SMT
R26 R28 R29 R43#2 = Res_2K2_0402: SMD Chip Resistor, 2.2 kOhm, ± 1%, 63 mW, 0402 [1005 Metric], Thick Film, Anti-Sulfur; Manufacturer: Yageo; Manufacturer Part Number: AF0402FR-072K2L; Value: 2.2kR; Max Power Dissipation: 63mW; Temperature Coefficient: 100ppm/°C; Voltage Rating: 50V; Supplier: Mouser; Supplier Part Number: 603-AF0402FR-072K2L; RoHS: Yes; Category: Chip SMD Resistors; Stock: 30667; Pricing: 1=0.1, 10=0.017, 50=0.017, 100=0.014, 1000=0.011, 10000=0.005 (USD); Case/Package: 0402; Min Operating Temperature: -55°C; Max Operating Temperature: 155°C; Packaging: Tape and Reel; Number of Terminations: 2; Tolerance: 1%; Features: Moisture Resistant,Anti-Sulfur; Series: AF; Length: 0.039inch; Width: 0.02inch; Height: 0.015inch; RoHS Compliant: Yes; ComponentLink1URL: http://www.yageo.com/documents/recent/PYu-AF_51_RoHS_L_5.pdf?src-supplier=Digikey; ComponentLink1Description: http://www.yageo.com/documents/recent/PYu-AF_51_RoHS_L_5.pdf?src-supplier=Digikey; Supplier 1: Mouser; Supplier Part Number 1: 603-AF0402FR-072K2L
Y1 = SIT8008BI-21-18E-37.125000: Oscillator MEMS 37.125MHz ±20ppm (Stability) 15pF HCMOS/LVCMOS 55% 1.8V Medical 4-Pin QFN SMD Bulk; Manufacturer: SiTime; Supplier: DigiKey; Supplier Part Number: 1473-SIT8008BI-21-18E-37.125000-ND; Manufacturer Part Number: SIT8008BI-21-18E-37.125000; Category: Oscillators; Pricing: 1=1.57, 10=1.362, 25=1.2876, 50=1.2344, 100=1.1833, 250=1.11904, 500=1.07278, 1000=1.02845, 2500=0.97269 (USD); Supplier 1: DigiKey; Supplier Part Number 1: 1473-SIT8008BI-21-18E-37.125000-ND; ComponentLink1URL: https://datasheet.octopart.com:443/SIT8008BI-21-18E-37.125000-SiTime-datasheet-181060505.pdf?src-supplier=SiTime+Direct; ComponentLink1Description: https://datasheet.octopart.com:443/SIT8008BI-21-18E-37.125000-SiTime-datasheet-181060505.pdf?src-supplier=SiTime+Direct; ComponentLink2URL: https://datasheet.octopart.com:443/SIT8008BI-21-18E-37.125000-SiTime-datasheet-168043894.pdf?src-supplier=SiTime+Direct; ComponentLink2Description: https://datasheet.octopart.com:443/SIT8008BI-21-18E-37.125000-SiTime-datasheet-168043894.pdf?src-supplier=SiTime+Direct

## Sheet Sensors.SchDoc
size A4; SheetNumber: 5; SheetTotal: 7
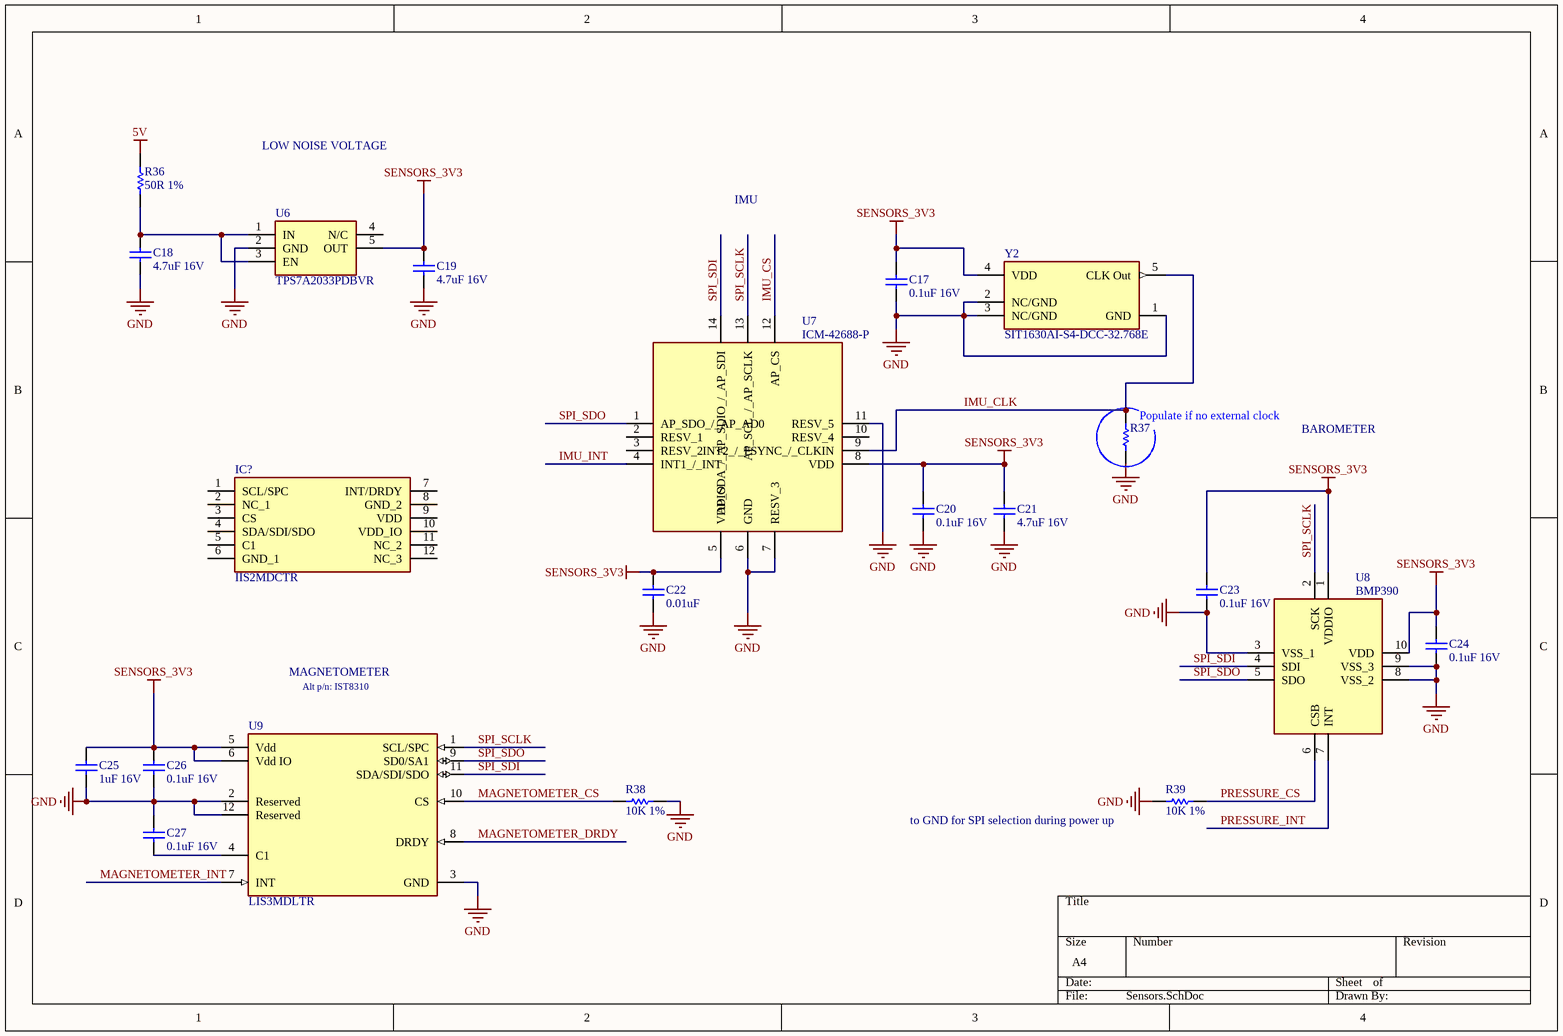
[diagram p4: Sensors.SchDoc]

### Parts
C17  0.1uF 16V  [0402]
C18  4.7uF 16V  [1608[0603]]
C19  4.7uF 16V  [1608[0603]]
C20  0.1uF 16V  [0402]
C21  4.7uF 16V  [1608[0603]]
C22  0.01uF  [0402]
C23  0.1uF 16V  [0402]
C24  0.1uF 16V  [0402]
C25  1uF 16V  [0402]
C26  0.1uF 16V  [0402]
C27  0.1uF 16V  [0402]
IC?  IIS2MDCTR  [IIS2MDCTR]
R36  50R 1%  [1608[0603]H05]
R37  0R  [0402]  (value not drawn)
R38  10K 1%  [0402]
R39  10K 1%  [0402]
U6  TPS7A2033PDBVR  [SOT95P280X145-5N]
U7  ICM-42688-P  [IIM42352]
U8  BMP390  [BMP390]
U9  LIS3MDLTR  [FP-VFLGA-12-8365767-MFG]
Y2  SIT1630AI-S4-DCC-32.768E  [FP-SiT1630-S-IPC_A]

### Nets
5V: R36.2
GND: C17.2 C18.1 C19.1 C20.1 C21.1 C22.2 C23.1 C24.1 C25.1 C26.1 C27.2 R37.1 R38.1 R39.2 U6.2(GND) U7.6(GND) U7.7(RESV_3) U7.11(RESV_5) U8.3(VSS_1) U8.8(VSS_2) U8.9(VSS_3) U9.2(Reserved) U9.3(GND) U9.12(Reserved) Y2.1(GND) Y2.2(NC/GND) Y2.3(NC/GND)
SENSORS_3V3: C17.1 C19.2 C20.2 C21.2 C22.1 C23.2 C24.2 C25.2 C26.2 U6.5(OUT) U7.5(VDDIO) U7.8(VDD) U8.1(VDDIO) U8.10(VDD) U9.5(Vdd) U9.6(Vdd_IO) Y2.4(VDD)
IMU_CLK: R37.2 U7.9(INT2_/_FSYNC_/_CLKIN) Y2.5(CLK_Out)
IMU_CS: U7.12(AP_CS)  [project net GPIO18]
IMU_INT: U7.4(INT1_/_INT)  [project net GPIO25]
MAGNETOMETER_CS: R38.2 U9.10(CS)  [project net GPIO17]
MAGNETOMETER_DRDY: U9.8(DRDY)  [project net GPIO26]
MAGNETOMETER_INT: U9.7(INT)  [project net GPIO24]
PRESSURE_CS: R39.1 U8.6(CSB)  [project net GPIO16]
PRESSURE_INT: U8.7(INT)  [project net GPIO27]
SPI_SCLK: U7.13(AP_SCL_/_AP_SCLK) U8.2(SCK) U9.1(SCL/SPC)  [project net GPIO21]
SPI_SDI: U7.14(AP_SDA_/_AP_SDIO_/_AP_SDI) U8.4(SDI) U9.11(SDA/SDI/SDO)  [project net GPIO20]
SPI_SDO: U7.1(AP_SDO_/_AP_AD0) U8.5(SDO) U9.9(SD0/SA1)  [project net GPIO19]
NetC18_2: C18.2 R36.1 U6.1(IN) U6.3(EN)
NetC27_1: C27.1 U9.4(C1)

Not connected (* = marked no-connect by the designer): IC? 1(SCL/SPC) 2(NC_1) 3(CS) 4(SDA/SDI/SDO) 5(C1) 6(GND_1) 7(INT/DRDY) 8(GND_2) 9(VDD) 10(VDD_IO) 11(NC_2) 12(NC_3); U6 4(N/C); U7 2(RESV_1) 3(RESV_2) 10(RESV_4)

### Notes on the sheet
- LOW NOISE VOLTAGE
- IMU
- (near R37) Populate if no external clock
- BAROMETER
- MAGNETOMETER
- Alt p/n: IST8310
- (near R39) to GND for SPI selection during power up

### Library data of the parts
C17 C20 C23 C24 C26 C27 = Cap0.1UF_16V_X7R: as C9 on sheet MIPI-CSI; RoHS: Yes; Category: Ceramic Capacitors; Stock 1: 2121057; Pricing 1: 1=0,10000, 10=0,01800, 50=0,01800, 100=0,01500, 1000=0,00900, 10000=0,00700 (USD); Mounting Technology: Surface Mount; Case/Package: 0402; Case Code (Imperial): 0402; Case Code (Metric): 1005; Min Operating Temperature: -55°C; Max Operating Temperature: 125°C; Tolerance: 10%; Voltage Rating: 16V; Voltage Rating (DC): 16V; Packaging: Tape and Reel; Package Quantity: 1; Dielectric: X7R; Termination: SMD/SMT; Series: GCM; Construction: Flat; Length: 1mm; Width: 0.5mm; Height: 0.5mm; Thickness: 0.022inch; Depth: 0.5mm; Ratings: AEC-Q200; Radiation Hardening: No; Lead Free: Lead Free; RoHS Compliant: Yes; ComponentLink1URL: https://datasheet.ciiva.com/11618/product-11618848.pdf?src-supplier=Avnet; ComponentLink1Description: https://datasheet.ciiva.com/11618/product-11618848.pdf?src-supplier=Avnet; ComponentLink2URL: https://datasheet.ciiva.com/16440/gcm155r71c104ka55j-16440393.pdf?src-supplier=Future+Electronics; ComponentLink2Description: https://datasheet.ciiva.com/16440/gcm155r71c104ka55j-16440393.pdf?src-supplier=Future+Electronics; ComponentLink3URL: https://datasheet.ciiva.com/29542/product-29542474.pdf?src-supplier=Digi-Key; ComponentLink3Description: https://datasheet.ciiva.com/29542/product-29542474.pdf?src-supplier=Digi-Key; ComponentLink4URL: https://datasheet.ciiva.com/29542/product-29542475.pdf?src-supplier=Digi-Key; ComponentLink4Description: https://datasheet.ciiva.com/29542/product-29542475.pdf?src-supplier=Digi-Key; Supplier 1: Mouser; Supplier 2: Digi-Key; Supplier Part Number 1: 81-GCM155R71C104KA5J; Supplier Part Number 2: 490-7998-1-ND
C18 C19 C21 = Cap4.7UF_16_0603: as C10 on sheet MIPI-CSI; Supplier 1: Digi-Key; RoHS: RoHS Compliant; Category: Capacitors; Stock 1: 166451; Pricing 1: 1=0.26, 10=0.216, 25=0.1484, 50=0.1216, 100=0.108, 500=0.07156, 1000=0.06345 (USD); Packaging: Cut Tape (CT); Voltage - Rated: 16V; Mounting Type: Surface Mount, MLCC; Operating Temperature: -55°C ~ 85°C; Applications: General Purpose; Ratings: -; Package / Case: 0603 (1608 Metric); Size / Dimension: 0.063" L x 0.031" W (1.60mm x 0.80mm); Height - Seated (Max): -; Thickness (Max): 0.035" (0.90mm); Lead Spacing: -; Features: -; Lead Style: -; ComponentLink1URL: http://www.samsungsem.com/kr/support/product-search/mlcc/CL10A475KO8NNNC.jsp; ComponentLink1Description: http://www.samsungsem.com/kr/support/product-search/mlcc/CL10A475KO8NNNC.jsp; Supplier Part Number 1: 1276-1784-1-ND
C22 = Cap0.01UF_25V: Ceramic Capacitor (Surface Mount); ComponentLink1URL: http://product.tdk.com/en/catalog/datasheets/mlcc_commercial_general_en.pdf; ComponentLink1Description: http://product.tdk.com/en/catalog/datasheets/mlcc_commercial_general_en.pdf; Supplier 1: Mouser; Supplier Part Number 1: 81-GCM155R71H103KA5J
C25 = Cap1UF_16V: Ceramic Capacitor (Surface Mount); Manufacturer: Taiyo Yuden; Manufacturer Part Number: EMK105BJ105KV-F; Capacitance: 1µF; Tolerance: ±10%; Temperature Coefficient: X5R; Supplier 1: Digi-Key; RoHS: RoHS Compliant; Category: Capacitors; Stock 1: 107475; Pricing 1: 1=0.1, 10=0.06, 50=0.0326, 100=0.0275, 250=0.02252, 500=0.01926, 1000=0.015, 5000=0.0125 (USD); Packaging: Cut Tape (CT); Voltage - Rated: 16V; Mounting Type: Surface Mount, MLCC; Operating Temperature: -55°C ~ 85°C; Applications: General Purpose; Ratings: -; Package / Case: 0402 (1005 Metric); Size / Dimension: 0.039" L x 0.020" W (1.00mm x 0.50mm); Height - Seated (Max): -; Thickness (Max): 0.022" (0.55mm); Lead Spacing: -; Features: -; Lead Style: -; ComponentLink1URL: http://ds.yuden.co.jp/TYCOMPAS/ut/detail.do?productNo=EMK105BJ105KV-F&fileName=EMK105BJ105KV-F_SS&mode=specSheetDownload; ComponentLink1Description: http://ds.yuden.co.jp/TYCOMPAS/ut/detail.do?productNo=EMK105BJ105KV-F&fileName=EMK105BJ105KV-F_SS&mode=specSheetDownload; Supplier Part Number 1: 587-2477-1-ND
IC? = IIS2MDCTR: Integrated Circuit; Manufacturer_Name: STMicroelectronics; Datasheet Link: https://www.st.com/resource/en/datasheet/iis2mdc.pdf; Height: 0.7mm; Manufacturer_Part_Number: IIS2MDCTR; Mouser Part Number: 511-IIS2MDCTR; Mouser Price/Stock: https://www.mouser.co.uk/ProductDetail/STMicroelectronics/IIS2MDCTR?qs=1mbolxNpo8ems1K%2FRdQzXg%3D%3D; Arrow Part Number: IIS2MDCTR; Arrow Price/Stock: https://www.arrow.com/en/products/iis2mdctr/stmicroelectronics?utm_currency=USD&region=europe
R36 = Res_50R_0603: Resistor,50R,0603,1%; Category: Resistors; Tolerance: ±1%; Supplier 1: Farnell; Supplier Part Number 1: 2112878
R37 = Res_0R_0402: as R14#1 on sheet MIPI-CSI; Value: 0R; Supplier 1: Digi-Key; RoHS: RoHS Compliant; Category: Resistors; Stock 1: 12447313; Pricing 1: 1=0.1, 10=0.013, 25=0.0092, 100=0.0053, 250=0.004, 500=0.0032, 1000=0.00236, 2500=0.00205, 5000=0.00169 (USD); Packaging: Cut Tape (CT); Tolerance: Jumper; Composition: Thick Film; Features: Moisture Resistant; Temperature Coefficient: -; Operating Temperature: -55°C ~ 155°C; Package / Case: 0402 (1005 Metric); Supplier Device Package: 0402; Size / Dimension: 0.039" L x 0.020" W (1.00mm x 0.50mm); Height: 0.016" (0.40mm); Number of Terminations: 2; ComponentLink1URL: http://www.yageo.com/documents/recent/PYu-RC_Group_51_RoHS_L_2.pdf; ComponentLink1Description: http://www.yageo.com/documents/recent/PYu-RC_Group_51_RoHS_L_2.pdf; Supplier Part Number 1: 311-0.0JRCT-ND; MountType: SMT
R38 R39 = Res_10K_0402: as R24 on sheet MIPI-CSI; Supplier 1: Digi-Key; RoHS: RoHS Compliant; Category: Resistors; Stock 1: 2634839; Pricing 1: 1=0.1, 10=0.013, 25=0.0096, 100=0.0054, 250=0.00412, 500=0.00328, 1000=0.00242, 2500=0.0021, 5000=0.00173 (USD); Packaging: Cut Tape (CT); Resistance (Ohms): 10k; Tolerance: ±1%; Composition: Thick Film; Features: Moisture Resistant; Operating Temperature: -55°C ~ 155°C; Package / Case: 0402 (1005 Metric); Supplier Device Package: 0402; Size / Dimension: 0.039" L x 0.020" W (1.00mm x 0.50mm); Height: 0.016" (0.40mm); Number of Terminations: 2; ComponentLink1URL: http://www.yageo.com/NewPortal/yageodocoutput?fileName=/pdf/R-Chip/PYu-RC_Group_51_RoHS_L_3.pdf; ComponentLink1Description: http://www.yageo.com/NewPortal/yageodocoutput?fileName=/pdf/R-Chip/PYu-RC_Group_51_RoHS_L_3.pdf; Supplier Part Number 1: 311-10.0KLRCT-ND; MountType: SMT
U6 = TPS7A2033PDBVR: Integrated Circuit; Manufacturer_Name: Texas Instruments; Datasheet Link: https://www.ti.com/lit/ds/symlink/tps7a20.pdf?ts=1603960048570&ref_url=https%253A%252F%252Fwww.ti.com%252Fstore%252Fti%252Fen%252Fp%252Fproduct%252F%253Fp%253DPTPS7A2045PDQNR%2526keyMatch%253DPTPS7A2045PDQNR%2526tisearch%253DSearch-EN-everything; Height: 1.45mm; Manufacturer_Part_Number: TPS7A2033PDBVR; Mouser Part Number: 595-TPS7A2033PDBVR; Mouser Price/Stock: https://www.mouser.co.uk/ProductDetail/Texas-Instruments/TPS7A2033PDBVR?qs=hd1VzrDQEGjk%2FOBnRfKB4A%3D%3D; Arrow Part Number: TPS7A2033PDBVR; Arrow Price/Stock: null?region=nac
U7 = ICM-42688-P: Accelerometer and Gyroscope 6-Axis MEMS Motion Tracking Device Digital-OUT 14-Pin LGA T/R; Manufacturer_Name: TDK; Manufacturer: TDK InvenSense; Max Supply Voltage: 3.6V; Min Supply Voltage: 1.71V; Datasheet Link: https://3cfeqx1hf82y3xcoull08ihx-wpengine.netdna-ssl.com/wp-content/uploads/2021/06/DS-000347-ICM-42688-P-v1.5.pdf; Manufacturer_Part_Number: ICM-42688-P; Mouser Part Number: 410-ICM-42688-P; Mouser Price/Stock: https://www.mouser.co.uk/ProductDetail/TDK-InvenSense/ICM-42688-P?qs=OlC7AqGiEDk8QrNAV728zw%3D%3D; Arrow Part Number: ICM-42688-P; Arrow Price/Stock: https://www.arrow.com/en/products/icm-42688-p/invensense?region=nac; Supplier: Digikey; Supplier Part Number: 1428-ICM-42688-PCT-ND; Manufacturer Part Number: ICM-42688-P; RoHS: No; Category: Linear ICs; Stock: 15557; Pricing: 1=6.99, 10=5.595, 25=5.1756, 100=4.4763, 500=4.19656, 1000=3.91678 (USD); Min Operating Temperature: -40°C; Max Operating Temperature: 85°C; Length: 2.5mm; Width: 3mm; Height: 970um; ComponentLink1URL: https://media.digikey.com/pdf/Data%20Sheets/TDK%20PDFs/ICM-42688-P_DS_Rev1.2.pdf?src-supplier=Digikey; ComponentLink1Description: https://media.digikey.com/pdf/Data%20Sheets/TDK%20PDFs/ICM-42688-P_DS_Rev1.2.pdf?src-supplier=Digikey; Supplier 1: Digikey; Supplier Part Number 1: 1428-ICM-42688-PCT-ND
U8 = BMP390: Pressure sensor, 300-1250hPa, 2.0*2.0*0.75mm, I2C/SPI; Manufacturer_Name: BOSCH; Manufacturer: Bosch Sensortec; Datasheet Link: https://www.bosch-sensortec.com/media/boschsensortec/downloads/datasheets/bst-bmp390-ds002.pdf; Height: 0.8mm; Manufacturer_Part_Number: BMP390; Mouser Part Number: 262-BMP390; Mouser Price/Stock: https://www.mouser.co.uk/ProductDetail/Bosch-Sensortec/BMP390?qs=QNEnbhJQKvYQVfvRMgo2YA%3D%3D; Arrow Part Number: BMP390; Arrow Price/Stock: https://www.arrow.com/en/products/bmp390/bosch?region=nac; Supplier: Future Electronics; Supplier Part Number: 3151950; Manufacturer Part Number: BMP390; RoHS: No; Category: Uncategorized; Stock: 210; Pricing: 1=3.08, 20=2.82, 150=2.64, 1000=2.48, 5000=2.34 (USD); Supplier 1: Mouser; Supplier Part Number 1: 262-BMP390
U9 = LIS3MDLTR: SENSOR MR I2C/SPI 12LGA; Manufacturer: STMicroelectronics; Sensor Output: I2C,SPI; Operating Supply Current: 40-270uA; Max Supply Voltage: 3.6V; Sensing Method: Magnetic; Min Supply Voltage: 1.71V; ComponentLink2URL: https://www.st.com/resource/en/datasheet/lis3mdl.pdf; Category: IC; Manufacturer Part Number: LIS3MDLTR; Octopart: https://octopart.com/lis3mdltr-stmicroelectronics-29403125; Automotive: No; ComponentLink2Description: Datasheet; RoHS: TRUE; Device Class L3: unset; Device Class L1: Sensors; Temperature: -40°C to +85°C; Height: 1mm; Mouser Description: Board Mount Hall Effect / Magnetic Sensors Ultra Lo-Pwr Hi Perf 3-Axis 1.9-3.6V; Temperature Range High: +85°C; Lead Free: Yes; Device Class L2: Magnetic Sensors; Footprint Url: https://www.st.com/content/ccc/resource/technical/document/technical_note/73/17/9c/16/dd/96/4a/01/CD00134799.pdf/files/CD00134799.pdf/jcr:content/translations/en.CD00134799.pdf; Temperature Range Low: -40°C; Package: VFLGA-12-8365767; Digikey Description: SENSOR MR I2C/SPI 12LGA; Supplier 1: Mouser; Supplier Part Number 1: 511-LIS3MDLTR
Y2 = CMP-25159-260193-1: MEMS OSC XO 32.7680KHZ LVCMOS; RoHS Compliant: Yes